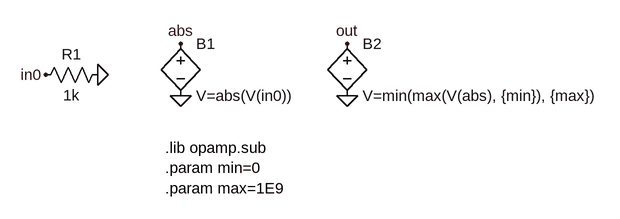
[diagram p0: schematic abs.asc]
abs.asc, the LTspice schematic file:
Version 4
SHEET 1 988 680
FLAG -64 160 in0
FLAG 16 160 0
FLAG 144 192 0
FLAG 144 112 abs
FLAG 400 192 0
FLAG 400 112 out
SYMBOL res 32 144 R90
WINDOW 0 0 56 VBottom 2
WINDOW 3 32 56 VTop 2
SYMATTR InstName R1
SYMATTR Value 1k
SYMBOL bv 144 96 R0
SYMATTR InstName B1
SYMATTR Value V=abs(V(in0))
SYMBOL bv 400 96 R0
SYMATTR InstName B2
SYMATTR Value V=min(max(V(abs), {min}), {max})
TEXT 120 272 Left 2 !.lib opamp.sub\n.param min=0\n.param max=1E9

The netlist it stands for:
* abs.asc
R1 0 in0 1k
B1 abs 0 V=abs(V(in0))
B2 out 0 V=min(max(V(abs), {min}), {max})
.lib opamp.sub
.param min=0
.param max=1E9
.backanno
.end